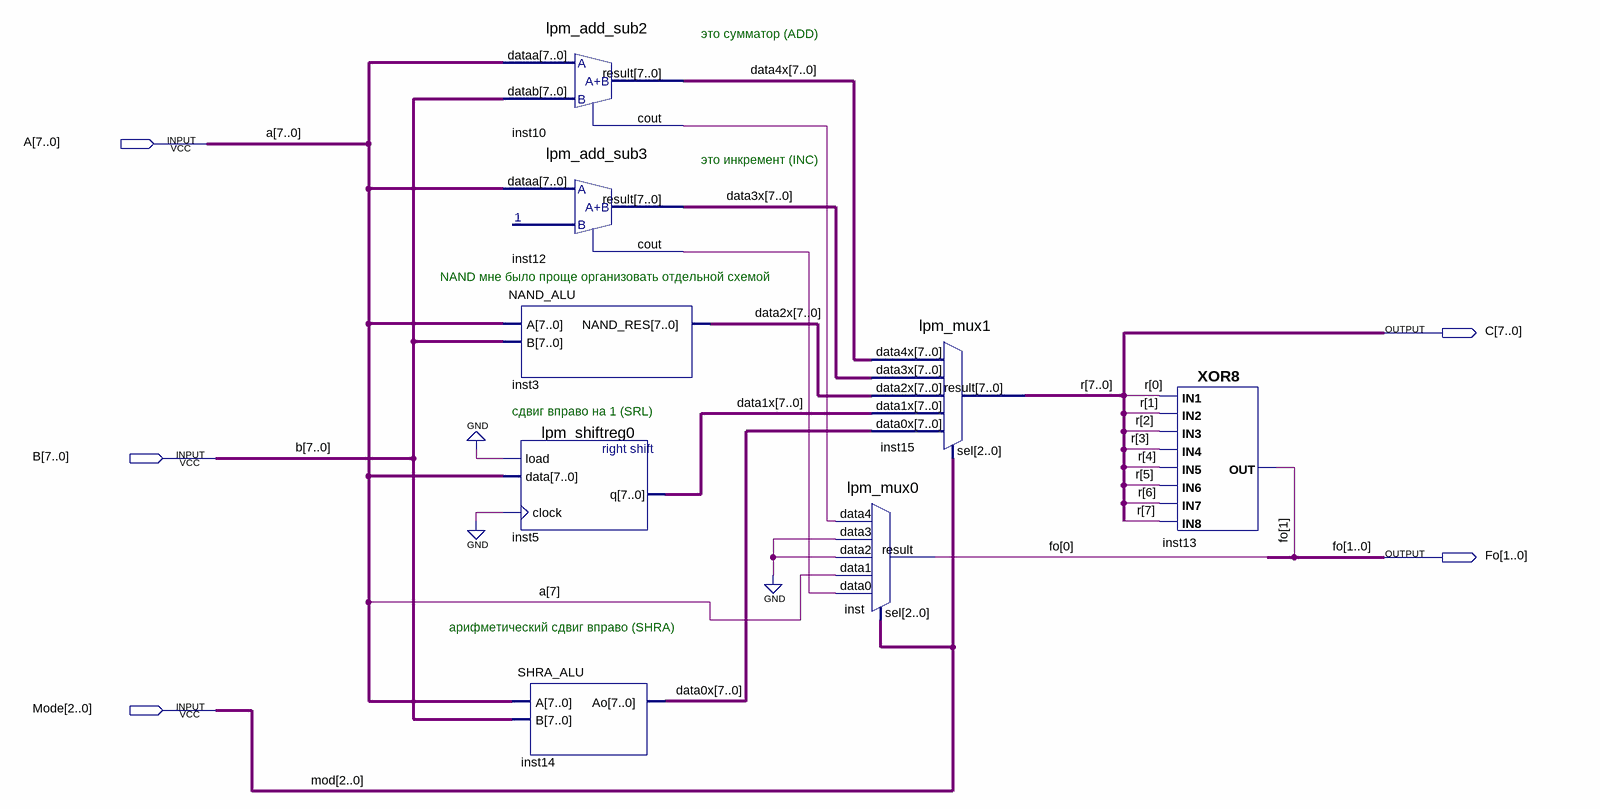
[diagram p0: schematic sheet]
// Quartus schematic TRUE_ALU.bdf as structural Verilog: 8 symbols, 5 pins
module TRUE_ALU (
  input  [7:0] A,
  input  [7:0] B,
  input  [2:0] Mode,
  output [7:0] C,
  output [1:0] Fo
);

  wire inst10_cout, inst12_cout;
  wire [7:0] data0x, data1x, data2x, data3x, data4x;

  lpm_add_sub2 inst10 (.dataa(A), .datab(B), .result(data4x), .cout(inst10_cout));
  lpm_add_sub3 inst12 (.dataa(A), .result(data3x), .cout(inst12_cout));
  NAND_ALU inst3 (.A(A), .B(B), .NAND_RES(data2x));
  lpm_shiftreg0 inst5 (.load(1'b0), .data(A), .clock(1'b0), .q(data1x));
  SHRA_ALU inst14 (.A(A), .B(B), .Ao(data0x));
  lpm_mux1 inst15 (
    .data4x(data4x), .data3x(data3x), .data2x(data2x), .data1x(data1x), .data0x(data0x), .sel(Mode),
    .result(C));
  lpm_mux0 inst (
    .data4(inst10_cout), .data3(1'b0), .data2(1'b0), .data1(A[7]), .data0(inst12_cout), .sel(Mode),
    .result(Fo[0]));
  XOR8 inst13 (
    .IN8(C[7]), .IN1(C[0]), .IN7(C[6]), .IN6(C[5]), .IN5(C[4]), .IN4(C[3]), .IN3(C[2]), .IN2(C[1]),
    .OUT(Fo[1]));

  // Other names for the same wires on the sheet: mod[2:0] = Mode; r[7:0] = C

  // Notes on the sheet:
  //   это сумматор (ADD)
  //   это инкремент (INC)
  //   NAND мне было проще организовать отдельной схемой
  //   сдвиг вправо на 1 (SRL)
  //   арифметический сдвиг вправо (SHRA)
endmodule
